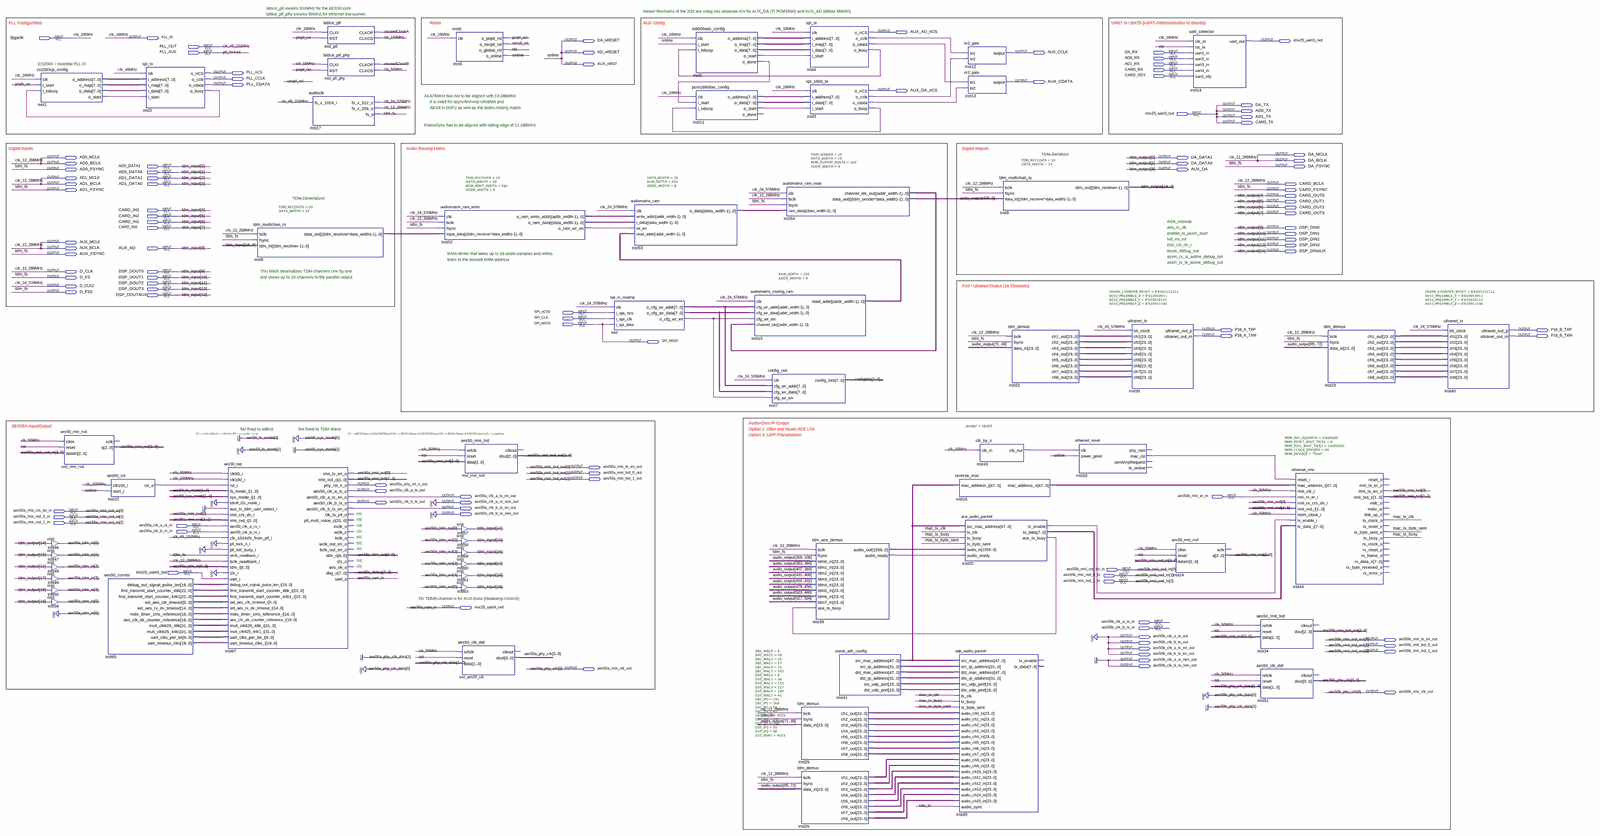
[diagram p0: schematic sheet, whole]
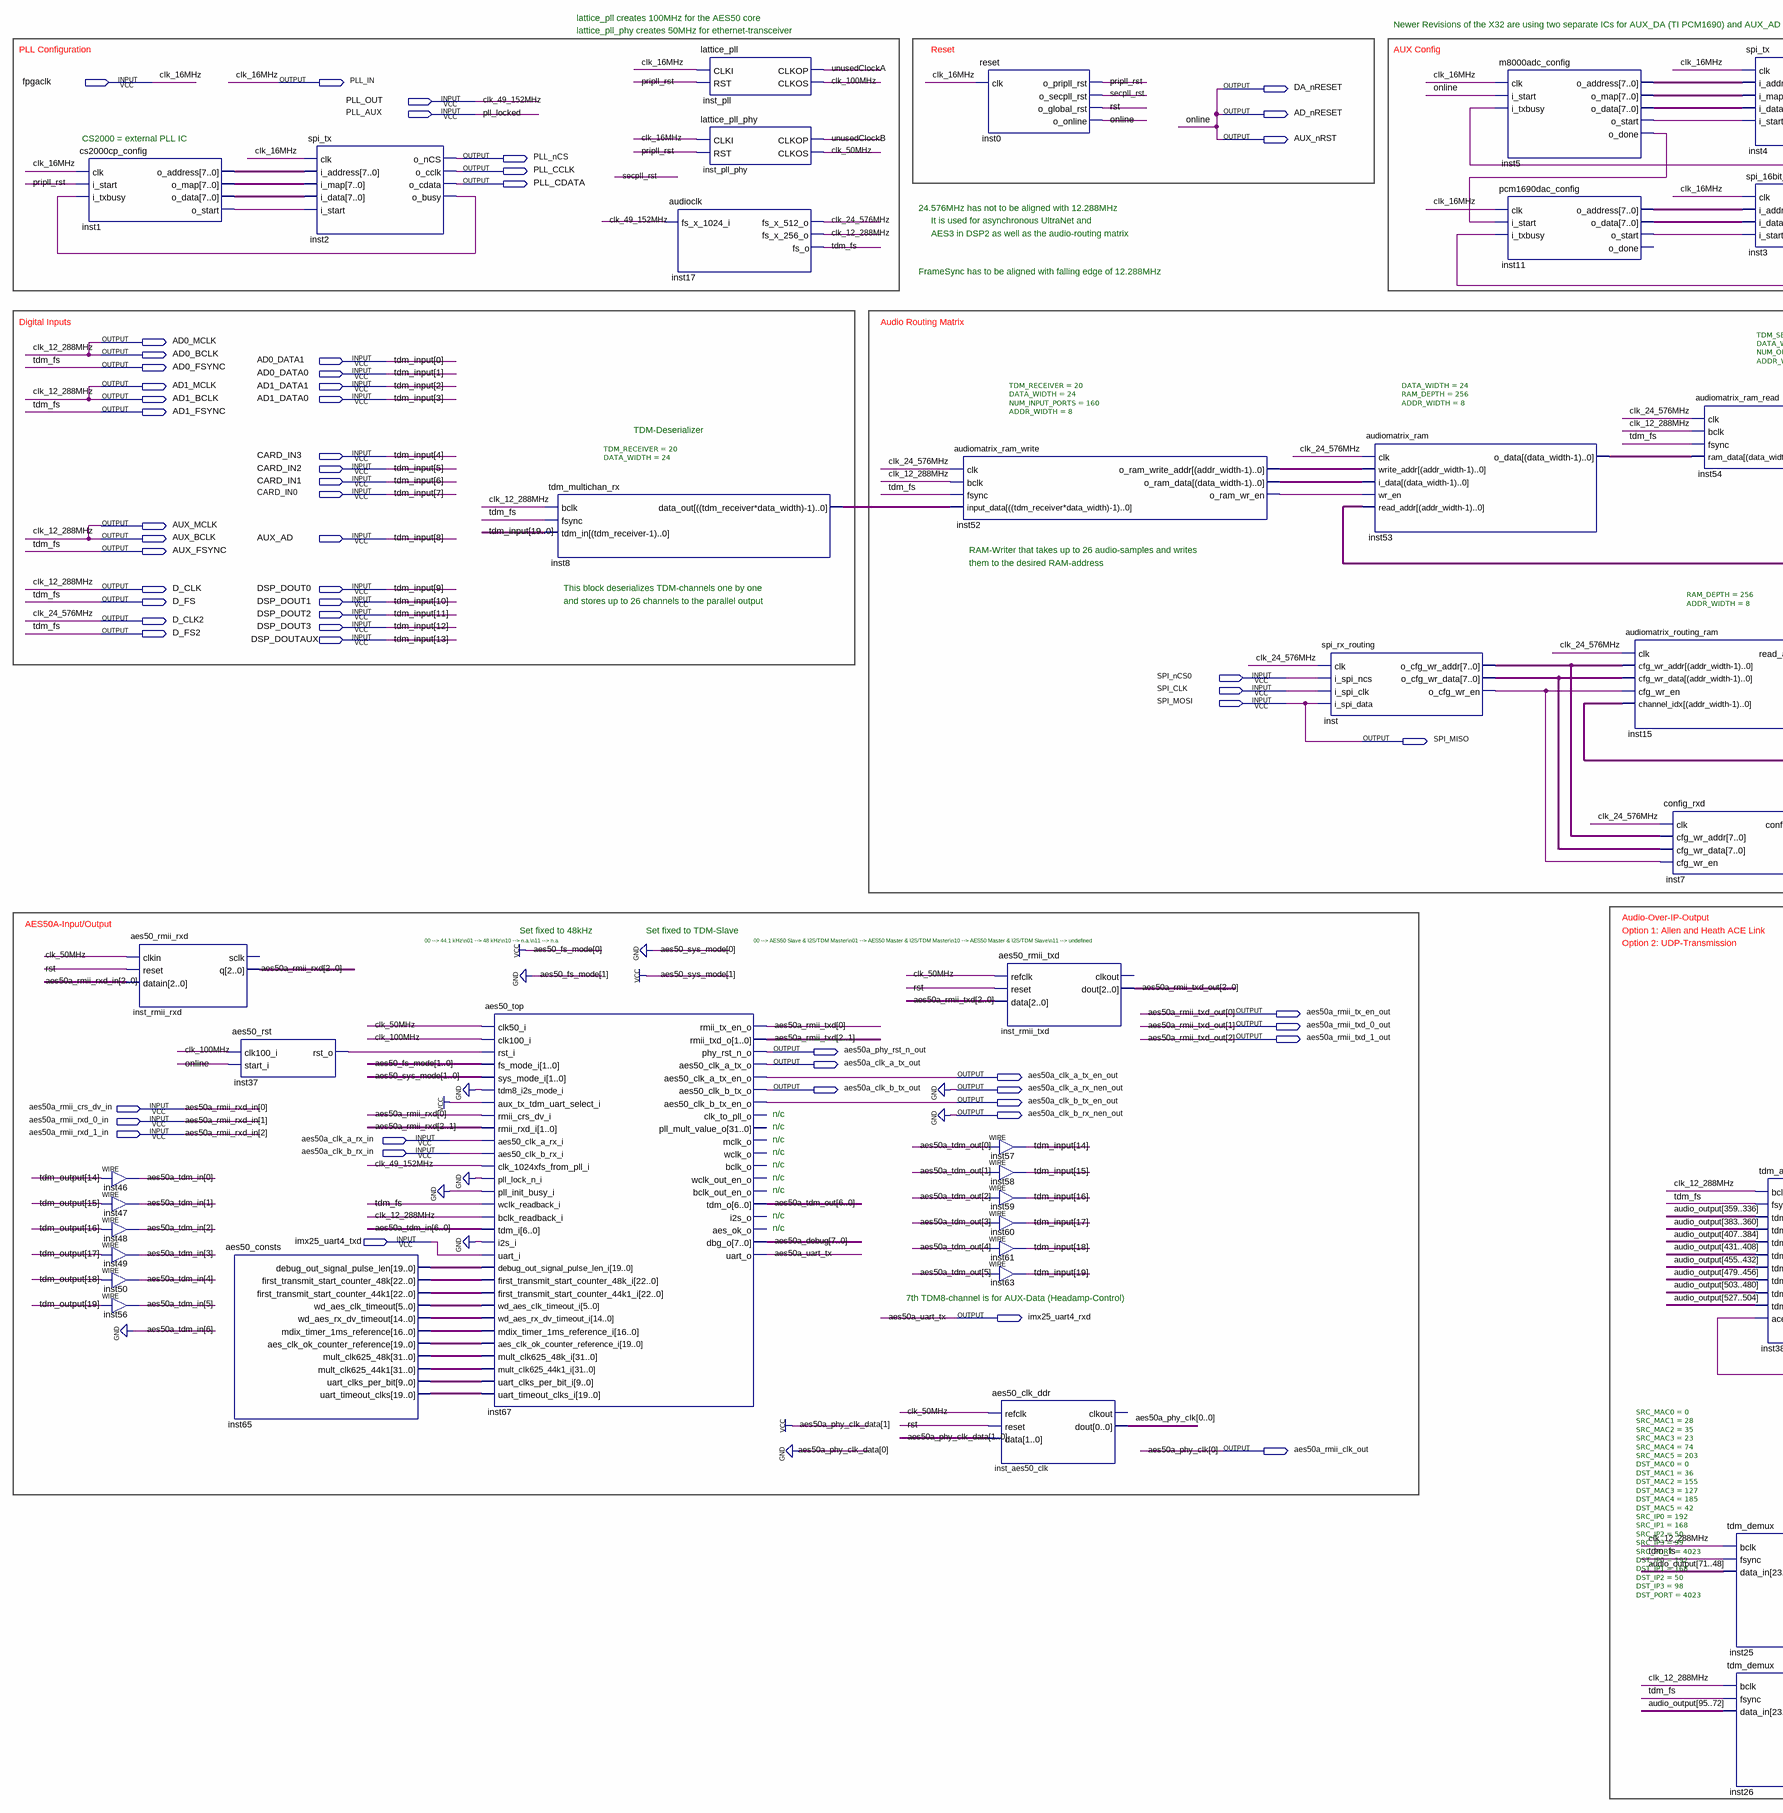
[diagram p1: schematic sheet, left part]
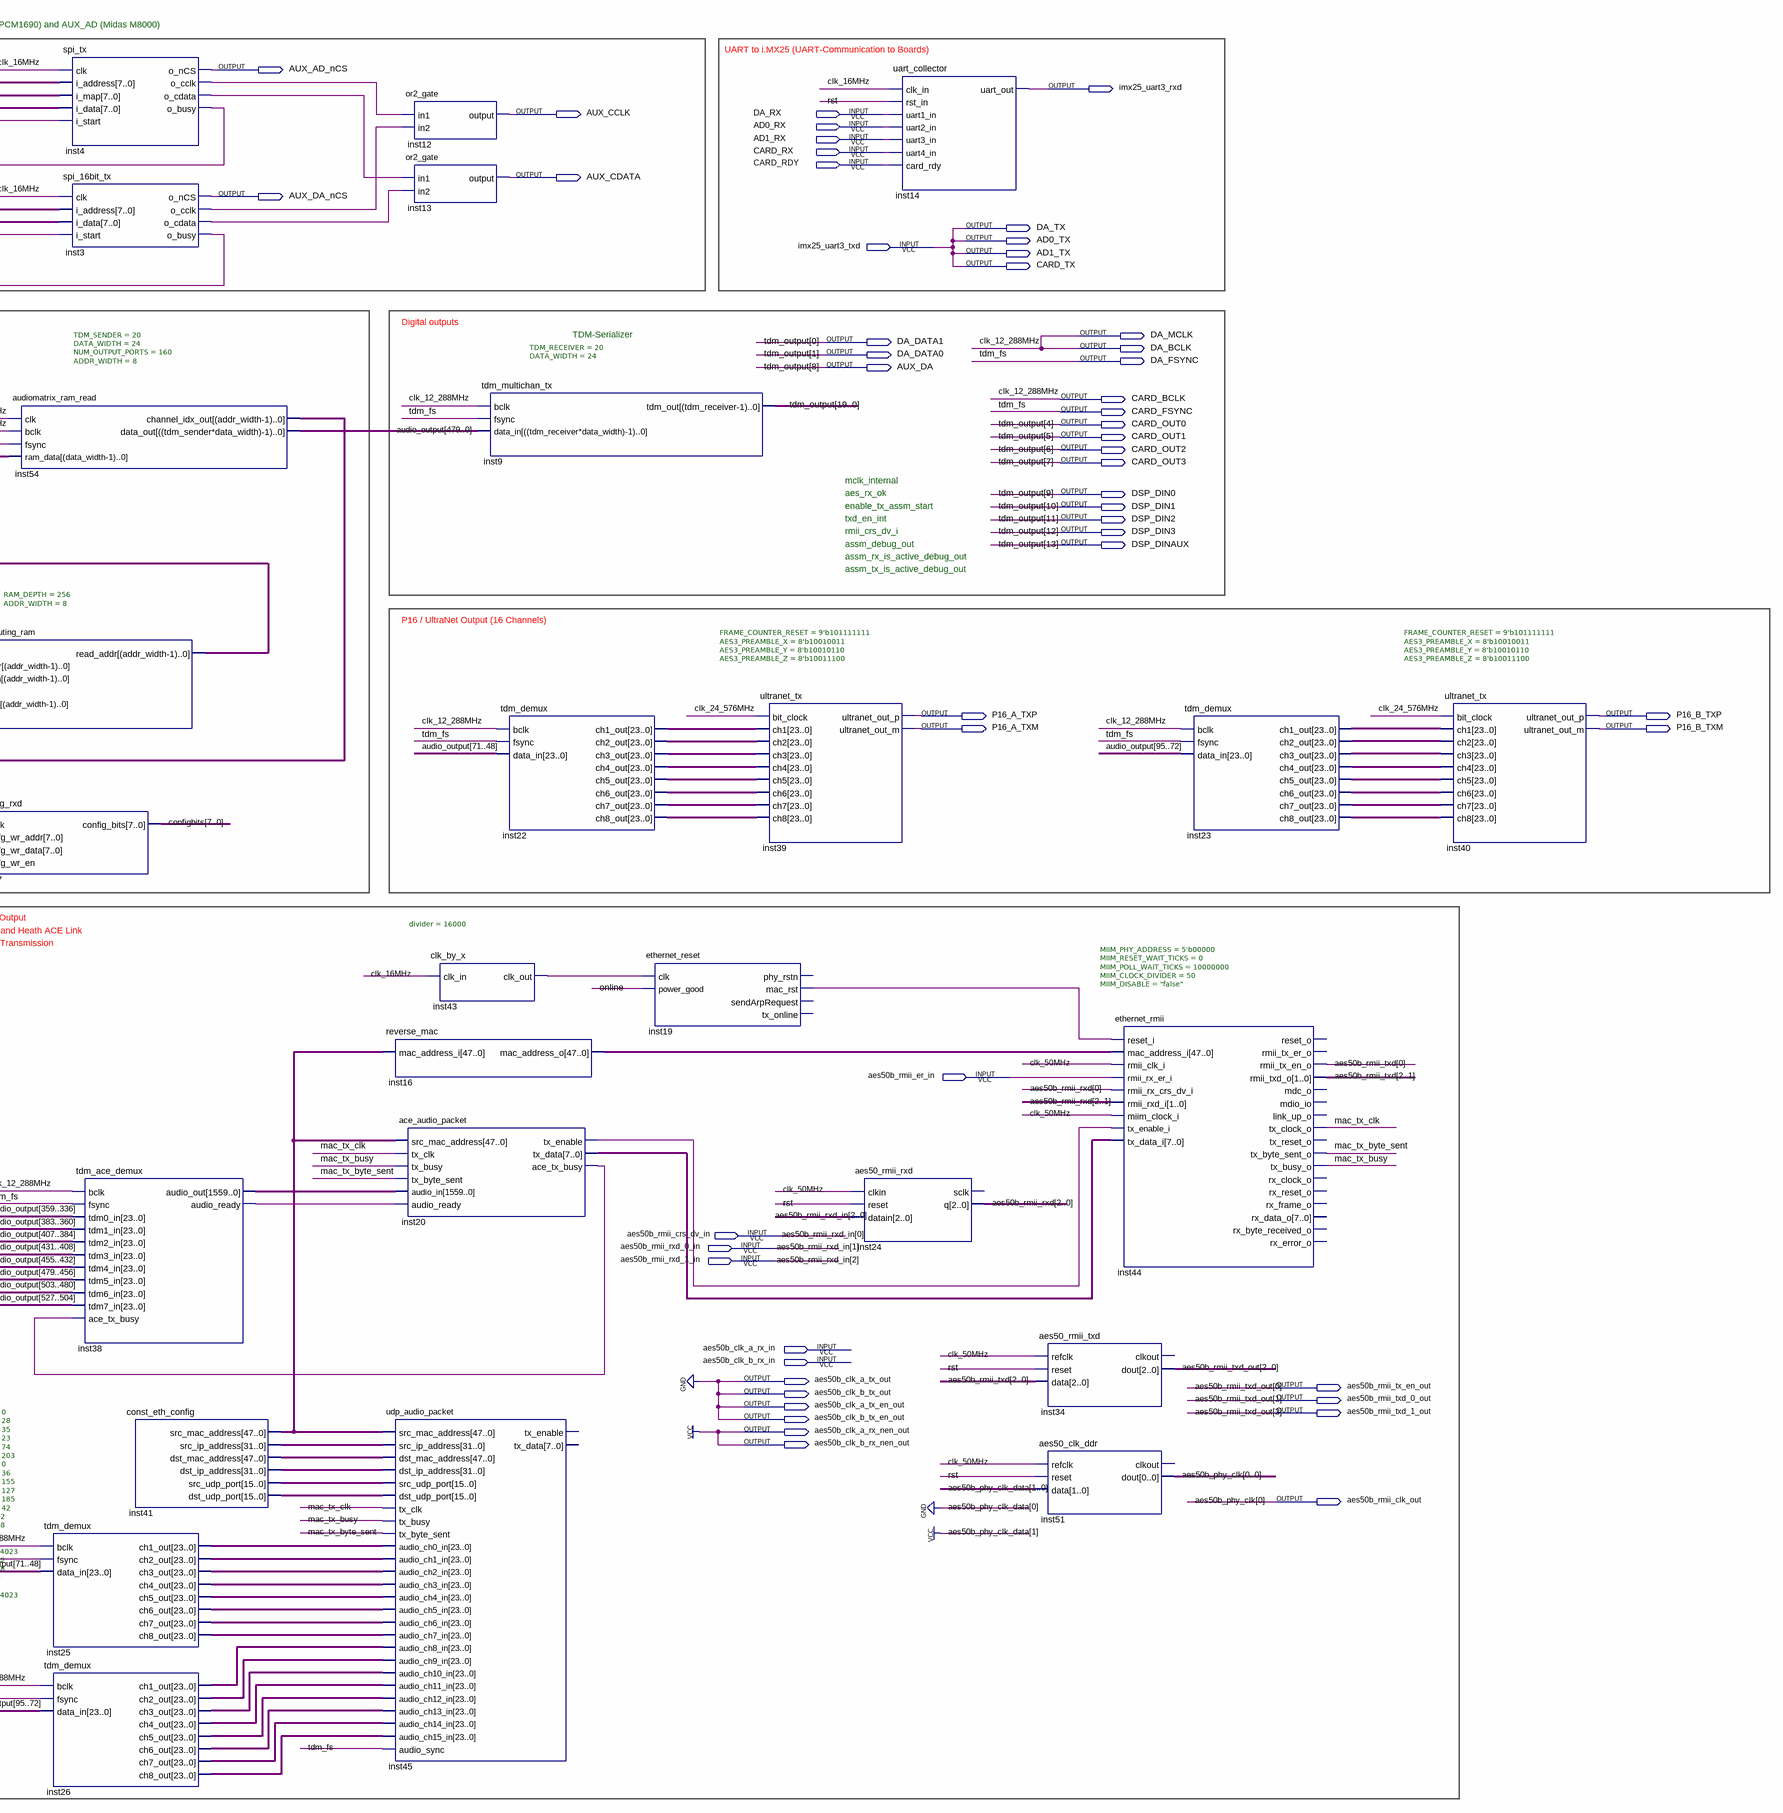
[diagram p2: schematic sheet, right part]
// Quartus schematic main_lattice.bdf as structural Verilog: 56 symbols, 111 pins
module main_lattice (
  input  fpgaclk,
  input  PLL_OUT,
  input  PLL_AUX,
  input  DA_RX,
  input  AD0_RX,
  input  AD1_RX,
  input  CARD_RX,
  input  CARD_RDY,
  input  imx25_uart3_txd,
  input  AD0_DATA1,
  input  AD0_DATA0,
  input  AD1_DATA1,
  input  AD1_DATA0,
  input  CARD_IN3,
  input  CARD_IN2,
  input  CARD_IN1,
  input  CARD_IN0,
  input  AUX_AD,
  input  DSP_DOUT0,
  input  DSP_DOUT1,
  input  DSP_DOUT2,
  input  DSP_DOUT3,
  input  DSP_DOUTAUX,
  input  SPI_nCS0,
  input  SPI_CLK,
  input  SPI_MOSI,
  input  aes50b_rmii_er_in,
  input  aes50a_rmii_crs_dv_in,
  input  aes50a_rmii_rxd_0_in,
  input  aes50a_rmii_rxd_1_in,
  input  aes50a_clk_a_rx_in,
  input  aes50a_clk_b_rx_in,
  input  aes50b_rmii_crs_dv_in,
  input  imx25_uart4_txd,
  input  aes50b_rmii_rxd_0_in,
  input  aes50b_rmii_rxd_1_in,
  input  aes50b_clk_a_rx_in,
  input  aes50b_clk_b_rx_in,
  output AUX_AD_nCS,
  output PLL_IN,
  output DA_nRESET,
  output imx25_uart3_rxd,
  output AD_nRESET,
  output AUX_CCLK,
  output AUX_nRST,
  output PLL_nCS,
  output PLL_CCLK,
  output AUX_CDATA,
  output PLL_CDATA,
  output AUX_DA_nCS,
  output DA_TX,
  output AD0_TX,
  output AD1_TX,
  output CARD_TX,
  output DA_MCLK,
  output AD0_MCLK,
  output DA_DATA1,
  output DA_BCLK,
  output AD0_BCLK,
  output DA_DATA0,
  output DA_FSYNC,
  output AD0_FSYNC,
  output AUX_DA,
  output AD1_MCLK,
  output AD1_BCLK,
  output CARD_BCLK,
  output AD1_FSYNC,
  output CARD_FSYNC,
  output CARD_OUT0,
  output CARD_OUT1,
  output CARD_OUT2,
  output CARD_OUT3,
  output DSP_DIN0,
  output DSP_DIN1,
  output DSP_DIN2,
  output AUX_MCLK,
  output DSP_DIN3,
  output AUX_BCLK,
  output DSP_DINAUX,
  output AUX_FSYNC,
  output D_CLK,
  output D_FS,
  output D_CLK2,
  output D_FS2,
  output P16_A_TXP,
  output P16_B_TXP,
  output P16_A_TXM,
  output P16_B_TXM,
  output SPI_MISO,
  output aes50a_rmii_tx_en_out,
  output aes50a_rmii_txd_0_out,
  output aes50a_rmii_txd_1_out,
  output aes50a_phy_rst_n_out,
  output aes50a_clk_a_tx_out,
  output aes50a_clk_a_tx_en_out,
  output aes50a_clk_b_tx_out,
  output aes50a_clk_a_rx_nen_out,
  output aes50a_clk_b_tx_en_out,
  output aes50a_clk_b_rx_nen_out,
  output imx25_uart4_rxd,
  output aes50b_clk_a_tx_out,
  output aes50b_rmii_tx_en_out,
  output aes50b_clk_b_tx_out,
  output aes50b_rmii_txd_0_out,
  output aes50b_clk_a_tx_en_out,
  output aes50b_rmii_txd_1_out,
  output aes50b_clk_b_tx_en_out,
  output aes50b_clk_a_rx_nen_out,
  output aes50b_clk_b_rx_nen_out,
  output aes50a_rmii_clk_out,
  output aes50b_rmii_clk_out
);

  wire clk_50MHz, clk_100MHz, inst1_o_start, inst2_o_busy, inst3_o_busy, inst3_o_cclk, inst3_o_cdata,
       inst4_o_busy, inst4_o_cclk, inst4_o_cdata, inst5_o_done, inst5_o_start, inst11_o_start,
       inst19_mac_rst, inst20_ace_tx_busy, inst20_tx_enable, inst37_rst_o, inst38_audio_ready,
       inst43_clk_out, inst52_o_ram_wr_en, inst_o_cfg_wr_en, mac_tx_busy, mac_tx_byte_sent, mac_tx_clk,
       pripll_rst, rst, secpll_rst, unusedClockA, unusedClockB;
  wire [2:0] aes50a_rmii_rxd, aes50a_rmii_txd, aes50b_rmii_rxd, aes50b_rmii_txd;
  wire [5:0] aes50a_tdm_in, inst65_wd_aes_clk_timeout;
  wire [6:0] aes50a_tdm_out;
  wire [7:0] aes50a_debug, configbits, inst1_o_address, inst1_o_data, inst1_o_map, inst5_o_address,
       inst5_o_data, inst5_o_map, inst11_o_address, inst11_o_data, inst15_read_addr, inst20_tx_data,
       inst52_o_ram_write_addr, inst54_channel_idx_out, inst_o_cfg_wr_addr, inst_o_cfg_wr_data;
  wire [9:0] inst65_uart_clks_per_bit;
  wire [14:0] inst65_wd_aes_rx_dv_timeout;
  wire [15:0] inst41_dst_udp_port, inst41_src_udp_port;
  wire [16:0] inst65_mdix_timer_1ms_reference;
  wire [19:0] inst65_aes_clk_ok_counter_reference, inst65_debug_out_signal_pulse_len,
       inst65_uart_timeout_clks;
  wire [19:2] tdm_output;
  wire [19:14] tdm_input;
  wire [22:0] inst65_first_transmit_start_counter_44k1, inst65_first_transmit_start_counter_48k;
  wire [23:0] inst22_ch1_out, inst22_ch2_out, inst22_ch3_out, inst22_ch4_out, inst22_ch5_out, inst22_ch6_out,
       inst22_ch7_out, inst22_ch8_out, inst23_ch1_out, inst23_ch2_out, inst23_ch3_out, inst23_ch4_out,
       inst23_ch5_out, inst23_ch6_out, inst23_ch7_out, inst23_ch8_out, inst25_ch1_out, inst25_ch2_out,
       inst25_ch3_out, inst25_ch4_out, inst25_ch5_out, inst25_ch6_out, inst25_ch7_out, inst25_ch8_out,
       inst26_ch1_out, inst26_ch2_out, inst26_ch3_out, inst26_ch4_out, inst26_ch5_out, inst26_ch6_out,
       inst26_ch7_out, inst26_ch8_out, inst52_o_ram_data, inst53_o_data;
  wire [31:0] inst41_dst_ip_address, inst41_src_ip_address, inst65_mult_clk625_44k1, inst65_mult_clk625_48k;
  wire [47:0] inst16_mac_address_o, inst41_dst_mac_address, inst41_src_mac_address;
  wire [479:0] inst8_data_out;
  wire [527:0] audio_output;
  wire [1559:0] inst38_audio_out;

  cs2000cp_config inst1 (
    .clk(fpgaclk), .i_start(pripll_rst), .i_txbusy(inst2_o_busy), .o_address(inst1_o_address),
    .o_map(inst1_o_map), .o_data(inst1_o_data), .o_start(inst1_o_start));
  aes50_rmii_rxd inst_rmii_rxd (
    .clkin(clk_50MHz), .reset(rst),
    .datain({aes50a_rmii_rxd_1_in, aes50a_rmii_rxd_0_in, aes50a_rmii_crs_dv_in}), .q(aes50a_rmii_rxd));  // open: sclk
  assign aes50a_tdm_in[0] = tdm_output[14];  // WIRE inst46
  assign aes50a_tdm_in[1] = tdm_output[15];  // WIRE inst47
  assign aes50a_tdm_in[2] = tdm_output[16];  // WIRE inst48
  assign aes50a_tdm_in[3] = tdm_output[17];  // WIRE inst49
  assign aes50a_tdm_in[4] = tdm_output[18];  // WIRE inst50
  assign aes50a_tdm_in[5] = tdm_output[19];  // WIRE inst56
  aes50_rst inst37 (.clk100_i(clk_100MHz), .start_i(AD_nRESET), .rst_o(inst37_rst_o));
  aes50_consts inst65 (
    .debug_out_signal_pulse_len(inst65_debug_out_signal_pulse_len),
    .first_transmit_start_counter_48k(inst65_first_transmit_start_counter_48k),
    .first_transmit_start_counter_44k1(inst65_first_transmit_start_counter_44k1),
    .wd_aes_clk_timeout(inst65_wd_aes_clk_timeout), .wd_aes_rx_dv_timeout(inst65_wd_aes_rx_dv_timeout),
    .mdix_timer_1ms_reference(inst65_mdix_timer_1ms_reference),
    .aes_clk_ok_counter_reference(inst65_aes_clk_ok_counter_reference),
    .mult_clk625_48k(inst65_mult_clk625_48k), .mult_clk625_44k1(inst65_mult_clk625_44k1),
    .uart_clks_per_bit(inst65_uart_clks_per_bit), .uart_timeout_clks(inst65_uart_timeout_clks));
  spi_tx inst2 (
    .clk(fpgaclk), .i_address(inst1_o_address), .i_map(inst1_o_map), .i_data(inst1_o_data),
    .i_start(inst1_o_start), .o_nCS(PLL_nCS), .o_cclk(PLL_CCLK), .o_cdata(PLL_CDATA), .o_busy(inst2_o_busy));
  aes50_top inst67 (
    .clk50_i(clk_50MHz), .clk100_i(clk_100MHz), .rst_i(inst37_rst_o), .fs_mode_i(2'b01), .sys_mode_i(2'b10),
    .tdm8_i2s_mode_i(1'b0), .aux_tx_tdm_uart_select_i(1'b1), .rmii_crs_dv_i(aes50a_rmii_rxd[0]),
    .rmii_rxd_i(aes50a_rmii_rxd[2:1]), .aes50_clk_a_rx_i(aes50a_clk_a_rx_in),
    .aes50_clk_b_rx_i(aes50a_clk_b_rx_in), .clk_1024xfs_from_pll_i(PLL_OUT), .pll_lock_n_i(1'b0),
    .pll_init_busy_i(1'b0), .wclk_readback_i(AD0_FSYNC), .bclk_readback_i(AD0_BCLK),
    .tdm_i({1'b0, aes50a_tdm_in}), .i2s_i(1'b0), .uart_i(imx25_uart4_txd),
    .debug_out_signal_pulse_len_i(inst65_debug_out_signal_pulse_len),
    .first_transmit_start_counter_48k_i(inst65_first_transmit_start_counter_48k),
    .first_transmit_start_counter_44k1_i(inst65_first_transmit_start_counter_44k1),
    .wd_aes_clk_timeout_i(inst65_wd_aes_clk_timeout), .wd_aes_rx_dv_timeout_i(inst65_wd_aes_rx_dv_timeout),
    .mdix_timer_1ms_reference_i(inst65_mdix_timer_1ms_reference),
    .aes_clk_ok_counter_reference_i(inst65_aes_clk_ok_counter_reference),
    .mult_clk625_48k_i(inst65_mult_clk625_48k), .mult_clk625_44k1_i(inst65_mult_clk625_44k1),
    .uart_clks_per_bit_i(inst65_uart_clks_per_bit), .uart_timeout_clks_i(inst65_uart_timeout_clks),
    .rmii_tx_en_o(aes50a_rmii_txd[0]), .rmii_txd_o(aes50a_rmii_txd[2:1]), .phy_rst_n_o(aes50a_phy_rst_n_out),
    .aes50_clk_a_tx_o(aes50a_clk_a_tx_out), .aes50_clk_a_tx_en_o(aes50a_clk_a_tx_en_out),
    .aes50_clk_b_tx_o(aes50a_clk_b_tx_out), .aes50_clk_b_tx_en_o(aes50a_clk_b_tx_en_out),
    .tdm_o(aes50a_tdm_out), .dbg_o(aes50a_debug), .uart_o(imx25_uart4_rxd));  // open: clk_to_pll_o, pll_mult_value_o, mclk_o, wclk_o, bclk_o, wclk_out_en_o, bclk_out_en_o, i2s_o, aes_ok_o
  tdm_multichan_rx #(.TDM_RECEIVER(20), .DATA_WIDTH(24)) inst8 (
    .bclk(AD0_BCLK), .fsync(AD0_FSYNC),
    .tdm_in({tdm_input, DSP_DOUTAUX, DSP_DOUT3, DSP_DOUT2, DSP_DOUT1, DSP_DOUT0, AUX_AD, CARD_IN0, CARD_IN1, CARD_IN2, CARD_IN3, AD1_DATA0, AD1_DATA1, AD0_DATA0, AD0_DATA1}),
    .data_out(inst8_data_out));
  audioclk inst17 (.fs_x_1024_i(PLL_OUT), .fs_x_512_o(D_CLK2), .fs_x_256_o(AD0_BCLK), .fs_o(AD0_FSYNC));
  lattice_pll inst_pll (.CLKI(fpgaclk), .RST(pripll_rst), .CLKOP(unusedClockA), .CLKOS(clk_100MHz));
  lattice_pll_phy inst_pll_phy (.CLKI(fpgaclk), .RST(pripll_rst), .CLKOP(unusedClockB), .CLKOS(clk_50MHz));
  reset inst0 (
    .clk(fpgaclk), .o_pripll_rst(pripll_rst), .o_secpll_rst(secpll_rst), .o_global_rst(rst),
    .o_online(AD_nRESET));
  audiomatrix_ram_write #(.TDM_RECEIVER(20), .DATA_WIDTH(24), .NUM_INPUT_PORTS(160), .ADDR_WIDTH(8)) inst52 (
    .clk(D_CLK2), .bclk(AD0_BCLK), .fsync(AD0_FSYNC), .input_data(inst8_data_out),
    .o_ram_write_addr(inst52_o_ram_write_addr), .o_ram_data(inst52_o_ram_data),
    .o_ram_wr_en(inst52_o_ram_wr_en));
  assign tdm_input[14] = aes50a_tdm_out[0];  // WIRE inst57
  assign tdm_input[15] = aes50a_tdm_out[1];  // WIRE inst58
  assign tdm_input[16] = aes50a_tdm_out[2];  // WIRE inst59
  assign tdm_input[17] = aes50a_tdm_out[3];  // WIRE inst60
  assign tdm_input[18] = aes50a_tdm_out[4];  // WIRE inst61
  assign tdm_input[19] = aes50a_tdm_out[5];  // WIRE inst63
  aes50_clk_ddr inst_aes50_clk (
    .refclk(clk_50MHz), .reset(rst), .data(2'b10), .dout(aes50a_rmii_clk_out));  // open: clkout
  aes50_rmii_txd inst_rmii_txd (
    .refclk(clk_50MHz), .reset(rst), .data(aes50a_rmii_txd),
    .dout({aes50a_rmii_txd_1_out, aes50a_rmii_txd_0_out, aes50a_rmii_tx_en_out}));  // open: clkout
  spi_rx_routing inst (
    .clk(D_CLK2), .i_spi_ncs(SPI_nCS0), .i_spi_clk(SPI_CLK), .i_spi_data(SPI_MOSI),
    .o_cfg_wr_addr(inst_o_cfg_wr_addr), .o_cfg_wr_data(inst_o_cfg_wr_data), .o_cfg_wr_en(inst_o_cfg_wr_en));
  audiomatrix_ram #(.DATA_WIDTH(24), .RAM_DEPTH(256), .ADDR_WIDTH(8)) inst53 (
    .clk(D_CLK2), .write_addr(inst52_o_ram_write_addr), .i_data(inst52_o_ram_data),
    .wr_en(inst52_o_ram_wr_en), .read_addr(inst15_read_addr), .o_data(inst53_o_data));
  m8000adc_config inst5 (
    .clk(fpgaclk), .i_start(AD_nRESET), .i_txbusy(inst4_o_busy), .o_address(inst5_o_address),
    .o_map(inst5_o_map), .o_data(inst5_o_data), .o_start(inst5_o_start), .o_done(inst5_o_done));
  pcm1690dac_config inst11 (
    .clk(fpgaclk), .i_start(inst5_o_done), .i_txbusy(inst3_o_busy), .o_address(inst11_o_address),
    .o_data(inst11_o_data), .o_start(inst11_o_start));  // open: o_done
  audiomatrix_routing_ram #(.RAM_DEPTH(256), .ADDR_WIDTH(8)) inst15 (
    .clk(D_CLK2), .cfg_wr_addr(inst_o_cfg_wr_addr), .cfg_wr_data(inst_o_cfg_wr_data),
    .cfg_wr_en(inst_o_cfg_wr_en), .channel_idx(inst54_channel_idx_out), .read_addr(inst15_read_addr));
  audiomatrix_ram_read #(.TDM_SENDER(20), .DATA_WIDTH(24), .NUM_OUTPUT_PORTS(160), .ADDR_WIDTH(8)) inst54 (
    .clk(D_CLK2), .bclk(AD0_BCLK), .fsync(AD0_FSYNC), .ram_data(inst53_o_data),
    .channel_idx_out(inst54_channel_idx_out), .data_out(audio_output[479:0]));
  config_rxd inst7 (
    .clk(D_CLK2), .cfg_wr_addr(inst_o_cfg_wr_addr), .cfg_wr_data(inst_o_cfg_wr_data),
    .cfg_wr_en(inst_o_cfg_wr_en), .config_bits(configbits));
  spi_tx inst4 (
    .clk(fpgaclk), .i_address(inst5_o_address), .i_map(inst5_o_map), .i_data(inst5_o_data),
    .i_start(inst5_o_start), .o_nCS(AUX_AD_nCS), .o_cclk(inst4_o_cclk), .o_cdata(inst4_o_cdata),
    .o_busy(inst4_o_busy));
  spi_16bit_tx inst3 (
    .clk(fpgaclk), .i_address(inst11_o_address), .i_data(inst11_o_data), .i_start(inst11_o_start),
    .o_nCS(AUX_DA_nCS), .o_cclk(inst3_o_cclk), .o_cdata(inst3_o_cdata), .o_busy(inst3_o_busy));
  tdm_demux inst25 (
    .bclk(AD0_BCLK), .fsync(AD0_FSYNC), .data_in(audio_output[71:48]), .ch1_out(inst25_ch1_out),
    .ch2_out(inst25_ch2_out), .ch3_out(inst25_ch3_out), .ch4_out(inst25_ch4_out), .ch5_out(inst25_ch5_out),
    .ch6_out(inst25_ch6_out), .ch7_out(inst25_ch7_out), .ch8_out(inst25_ch8_out));
  tdm_demux inst26 (
    .bclk(AD0_BCLK), .fsync(AD0_FSYNC), .data_in(audio_output[95:72]), .ch1_out(inst26_ch1_out),
    .ch2_out(inst26_ch2_out), .ch3_out(inst26_ch3_out), .ch4_out(inst26_ch4_out), .ch5_out(inst26_ch5_out),
    .ch6_out(inst26_ch6_out), .ch7_out(inst26_ch7_out), .ch8_out(inst26_ch8_out));
  tdm_ace_demux inst38 (
    .bclk(AD0_BCLK), .fsync(AD0_FSYNC), .tdm0_in(audio_output[359:336]), .tdm1_in(audio_output[383:360]),
    .tdm2_in(audio_output[407:384]), .tdm3_in(audio_output[431:408]), .tdm4_in(audio_output[455:432]),
    .tdm5_in(audio_output[479:456]), .tdm6_in(audio_output[503:480]), .tdm7_in(audio_output[527:504]),
    .ace_tx_busy(inst20_ace_tx_busy), .audio_out(inst38_audio_out), .audio_ready(inst38_audio_ready));
  const_eth_config #(.SRC_MAC0(0), .SRC_MAC1(28), .SRC_MAC2(35), .SRC_MAC3(23), .SRC_MAC4(74), .SRC_MAC5(203), .DST_MAC0(0), .DST_MAC1(36), .DST_MAC2(155), .DST_MAC3(127), .DST_MAC4(185), .DST_MAC5(42), .SRC_IP0(192), .SRC_IP1(168), .SRC_IP2(50), .SRC_IP3(99), .SRC_PORT(4023), .DST_IP0(192), .DST_IP1(168), .DST_IP2(50), .DST_IP3(98), .DST_PORT(4023)) inst41 (
    .src_mac_address(inst41_src_mac_address), .src_ip_address(inst41_src_ip_address),
    .dst_mac_address(inst41_dst_mac_address), .dst_ip_address(inst41_dst_ip_address),
    .src_udp_port(inst41_src_udp_port), .dst_udp_port(inst41_dst_udp_port));
  or2_gate inst12 (.in1(inst4_o_cclk), .in2(inst3_o_cclk), .\output (AUX_CCLK));
  or2_gate inst13 (.in1(inst4_o_cdata), .in2(inst3_o_cdata), .\output (AUX_CDATA));
  reverse_mac inst16 (.mac_address_i(inst41_src_mac_address), .mac_address_o(inst16_mac_address_o));
  ace_audio_packet inst20 (
    .src_mac_address(inst41_src_mac_address), .tx_clk(mac_tx_clk), .tx_busy(mac_tx_busy),
    .tx_byte_sent(mac_tx_byte_sent), .audio_in(inst38_audio_out), .audio_ready(inst38_audio_ready),
    .tx_enable(inst20_tx_enable), .tx_data(inst20_tx_data), .ace_tx_busy(inst20_ace_tx_busy));
  udp_audio_packet inst45 (
    .src_mac_address(inst41_src_mac_address), .src_ip_address(inst41_src_ip_address),
    .dst_mac_address(inst41_dst_mac_address), .dst_ip_address(inst41_dst_ip_address),
    .src_udp_port(inst41_src_udp_port), .dst_udp_port(inst41_dst_udp_port), .tx_clk(mac_tx_clk),
    .tx_busy(mac_tx_busy), .tx_byte_sent(mac_tx_byte_sent), .audio_ch0_in(inst25_ch1_out),
    .audio_ch1_in(inst25_ch2_out), .audio_ch2_in(inst25_ch3_out), .audio_ch3_in(inst25_ch4_out),
    .audio_ch4_in(inst25_ch5_out), .audio_ch5_in(inst25_ch6_out), .audio_ch6_in(inst25_ch7_out),
    .audio_ch7_in(inst25_ch8_out), .audio_ch8_in(inst26_ch1_out), .audio_ch9_in(inst26_ch2_out),
    .audio_ch10_in(inst26_ch3_out), .audio_ch11_in(inst26_ch4_out), .audio_ch12_in(inst26_ch5_out),
    .audio_ch13_in(inst26_ch6_out), .audio_ch14_in(inst26_ch7_out), .audio_ch15_in(inst26_ch8_out),
    .audio_sync(AD0_FSYNC));  // open: tx_enable, tx_data
  clk_by_x #(.divider(16000)) inst43 (.clk_in(fpgaclk), .clk_out(inst43_clk_out));
  tdm_multichan_tx #(.TDM_RECEIVER(20), .DATA_WIDTH(24)) inst9 (
    .bclk(AD0_BCLK), .fsync(AD0_FSYNC), .data_in(audio_output[479:0]),
    .tdm_out({tdm_output[19:14], DSP_DINAUX, DSP_DIN3, DSP_DIN2, DSP_DIN1, DSP_DIN0, AUX_DA, CARD_OUT3, CARD_OUT2, CARD_OUT1, CARD_OUT0, tdm_output[3:2], DA_DATA0, DA_DATA1}));
  tdm_demux inst22 (
    .bclk(AD0_BCLK), .fsync(AD0_FSYNC), .data_in(audio_output[71:48]), .ch1_out(inst22_ch1_out),
    .ch2_out(inst22_ch2_out), .ch3_out(inst22_ch3_out), .ch4_out(inst22_ch4_out), .ch5_out(inst22_ch5_out),
    .ch6_out(inst22_ch6_out), .ch7_out(inst22_ch7_out), .ch8_out(inst22_ch8_out));
  ethernet_reset inst19 (
    .clk(inst43_clk_out), .power_good(AD_nRESET), .mac_rst(inst19_mac_rst));  // open: phy_rstn, sendArpRequest, tx_online
  ultranet_tx #(.FRAME_COUNTER_RESET(9'b101111111), .AES3_PREAMBLE_X(8'b10010011), .AES3_PREAMBLE_Y(8'b10010110), .AES3_PREAMBLE_Z(8'b10011100)) inst39 (
    .bit_clock(D_CLK2), .ch1(inst22_ch1_out), .ch2(inst22_ch2_out), .ch3(inst22_ch3_out),
    .ch4(inst22_ch4_out), .ch5(inst22_ch5_out), .ch6(inst22_ch6_out), .ch7(inst22_ch7_out),
    .ch8(inst22_ch8_out), .ultranet_out_p(P16_A_TXP), .ultranet_out_m(P16_A_TXM));
  aes50_rmii_rxd inst24 (
    .clkin(clk_50MHz), .reset(rst),
    .datain({aes50b_rmii_rxd_1_in, aes50b_rmii_rxd_0_in, aes50b_rmii_crs_dv_in}), .q(aes50b_rmii_rxd));  // open: sclk
  uart_collector inst14 (
    .clk_in(fpgaclk), .rst_in(rst), .uart1_in(DA_RX), .uart2_in(AD0_RX), .uart3_in(AD1_RX),
    .uart4_in(CARD_RX), .card_rdy(CARD_RDY), .uart_out(imx25_uart3_rxd));
  aes50_rmii_txd inst34 (
    .refclk(clk_50MHz), .reset(rst), .data(aes50b_rmii_txd),
    .dout({aes50b_rmii_txd_1_out, aes50b_rmii_txd_0_out, aes50b_rmii_tx_en_out}));  // open: clkout
  aes50_clk_ddr inst51 (.refclk(clk_50MHz), .reset(rst), .data(2'b10), .dout(aes50b_rmii_clk_out));  // open: clkout
  ethernet_rmii #(.MIIM_PHY_ADDRESS(5'b00000), .MIIM_RESET_WAIT_TICKS(0), .MIIM_POLL_WAIT_TICKS(10000000), .MIIM_CLOCK_DIVIDER(50), .MIIM_DISABLE("false")) inst44 (
    .reset_i(inst19_mac_rst), .mac_address_i(inst16_mac_address_o), .rmii_clk_i(clk_50MHz),
    .rmii_rx_er_i(aes50b_rmii_er_in), .rmii_rx_crs_dv_i(aes50b_rmii_rxd[0]),
    .rmii_rxd_i(aes50b_rmii_rxd[2:1]), .miim_clock_i(clk_50MHz), .tx_enable_i(inst20_tx_enable),
    .tx_data_i(inst20_tx_data), .rmii_tx_en_o(aes50b_rmii_txd[0]), .rmii_txd_o(aes50b_rmii_txd[2:1]),
    .tx_clock_o(mac_tx_clk), .tx_byte_sent_o(mac_tx_byte_sent), .tx_busy_o(mac_tx_busy));  // open: reset_o, rmii_tx_er_o, mdc_o, link_up_o, tx_reset_o, rx_clock_o, rx_reset_o, rx_frame_o, rx_data_o, rx_byte_received_o, rx_error_o, mdio_io
  tdm_demux inst23 (
    .bclk(AD0_BCLK), .fsync(AD0_FSYNC), .data_in(audio_output[95:72]), .ch1_out(inst23_ch1_out),
    .ch2_out(inst23_ch2_out), .ch3_out(inst23_ch3_out), .ch4_out(inst23_ch4_out), .ch5_out(inst23_ch5_out),
    .ch6_out(inst23_ch6_out), .ch7_out(inst23_ch7_out), .ch8_out(inst23_ch8_out));
  ultranet_tx #(.FRAME_COUNTER_RESET(9'b101111111), .AES3_PREAMBLE_X(8'b10010011), .AES3_PREAMBLE_Y(8'b10010110), .AES3_PREAMBLE_Z(8'b10011100)) inst40 (
    .bit_clock(D_CLK2), .ch1(inst23_ch1_out), .ch2(inst23_ch2_out), .ch3(inst23_ch3_out),
    .ch4(inst23_ch4_out), .ch5(inst23_ch5_out), .ch6(inst23_ch6_out), .ch7(inst23_ch7_out),
    .ch8(inst23_ch8_out), .ultranet_out_p(P16_B_TXP), .ultranet_out_m(P16_B_TXM));

  assign AD0_MCLK = AD0_BCLK;
  assign AD0_TX = imx25_uart3_txd;
  assign AD1_BCLK = AD0_BCLK;
  assign AD1_FSYNC = AD0_FSYNC;
  assign AD1_MCLK = AD0_BCLK;
  assign AD1_TX = imx25_uart3_txd;
  assign aes50a_clk_a_rx_nen_out = 1'b0;
  assign aes50a_clk_b_rx_nen_out = 1'b0;
  assign aes50b_clk_a_rx_nen_out = 1'b1;
  assign aes50b_clk_a_tx_en_out = 1'b0;
  assign aes50b_clk_a_tx_out = 1'b0;
  assign aes50b_clk_b_rx_nen_out = 1'b1;
  assign aes50b_clk_b_tx_en_out = 1'b0;
  assign aes50b_clk_b_tx_out = 1'b0;
  assign AUX_BCLK = AD0_BCLK;
  assign AUX_FSYNC = AD0_FSYNC;
  assign AUX_MCLK = AD0_BCLK;
  assign AUX_nRST = AD_nRESET;
  assign CARD_BCLK = AD0_BCLK;
  assign CARD_FSYNC = AD0_FSYNC;
  assign CARD_TX = imx25_uart3_txd;
  assign D_CLK = AD0_BCLK;
  assign D_FS = AD0_FSYNC;
  assign D_FS2 = AD0_FSYNC;
  assign DA_BCLK = AD0_BCLK;
  assign DA_FSYNC = AD0_FSYNC;
  assign DA_MCLK = AD0_BCLK;
  assign DA_nRESET = AD_nRESET;
  assign DA_TX = imx25_uart3_txd;
  assign PLL_IN = fpgaclk;
  assign SPI_MISO = SPI_MOSI;

  // Other names for the same wires on the sheet: clk_12_288MHz = AD0_BCLK; aes50a_phy_clk[0] = aes50a_rmii_clk_out;
  //   aes50a_rmii_rxd_in[2:0] = {aes50a_rmii_rxd_1_in, aes50a_rmii_rxd_0_in, aes50a_rmii_crs_dv_in};
  //   aes50a_rmii_txd_out[2:0] = {aes50a_rmii_txd_1_out, aes50a_rmii_txd_0_out, aes50a_rmii_tx_en_out};
  //   aes50a_uart_tx = imx25_uart4_rxd; aes50b_phy_clk[0] = aes50b_rmii_clk_out;
  //   aes50b_rmii_rxd_in[2:0] = {aes50b_rmii_rxd_1_in, aes50b_rmii_rxd_0_in, aes50b_rmii_crs_dv_in};
  //   aes50b_rmii_txd_out[2:0] = {aes50b_rmii_txd_1_out, aes50b_rmii_txd_0_out, aes50b_rmii_tx_en_out};
  //   clk_16MHz = fpgaclk; clk_24_576MHz = D_CLK2; clk_49_152MHz = PLL_OUT; online = AD_nRESET; pll_locked = PLL_AUX;
  //   tdm_fs = AD0_FSYNC;
  //   tdm_input[13:0] = {DSP_DOUTAUX, DSP_DOUT3, DSP_DOUT2, DSP_DOUT1, DSP_DOUT0, AUX_AD, CARD_IN0, CARD_IN1, CARD_IN2, CARD_IN3, AD1_DATA0, AD1_DATA1, AD0_DATA0, AD0_DATA1};
  //   tdm_output (some bits) = {DSP_DINAUX, DSP_DIN3, DSP_DIN2, DSP_DIN1, DSP_DIN0, AUX_DA, CARD_OUT3, CARD_OUT2, CARD_OUT1, CARD_OUT0, DA_DATA0, DA_DATA1}

  // Notes on the sheet:
  //   lattice_pll creates 100MHz for the AES50 core
  //   Newer Revisions of the X32 are using two separate ICs for AUX_DA (TI PCM1690) and AUX_AD (Midas M8000)
  //   lattice_pll_phy creates 50MHz for ethernet-transceiver
  //   PLL Configuration
  //   Reset
  //   AUX Config
  //   UART to i.MX25 (UART-Communication to Boards)
  //   CS2000 = external PLL IC
  //   24.576MHz has not to be aligned with 12.288MHz
  //   It is used for asynchronous UltraNet and
  //   AES3 in DSP2 as well as the audio-routing matrix
  //   FrameSync has to be aligned with falling edge of 12.288MHz
  //   Digital Inputs
  //   Audio Routing Matrix
  //   Digital outputs
  //   TDM-Serializer
  //   TDM-Deserializer
  //   mclk_internal
  //   aes_rx_ok
  //   enable_tx_assm_start
  //   txd_en_int
  //   rmii_crs_dv_i
  //   assm_debug_out
  //   RAM-Writer that takes up to 26 audio-samples and writes
  //   assm_rx_is_active_debug_out
  //   them to the desired RAM-address
  //   assm_tx_is_active_debug_out
  //   This block deserializes TDM-channels one by one
  //   and stores up to 26 channels to the parallel output
  //   P16 / UltraNet Output (16 Channels)
  //   Audio-Over-IP-Output
  //   AES50A-Input/Output
  //   Set fixed to 48kHz
  //   Set fixed to TDM-Slave
  //   Option 1: Allen and Heath ACE Link
  //   00 --> 44.1 kHz\n01 --> 48 kHz\n10 --> n.a.\n11 --> n.a.
  //   00 --> AES50 Slave & I2S/TDM Master\n01 --> AES50 Master & I2S/TDM Master\n10 --> AES50 Master & I2S/TDM Slave\n11 --> undefined
  //   Option 2: UDP-Transmission
  //   n/c
  //   n/c
  //   n/c
  //   n/c
  //   n/c
  //   n/c
  //   n/c
  //   n/c
  //   n/c
  //   7th TDM8-channel is for AUX-Data (Headamp-Control)
endmodule
